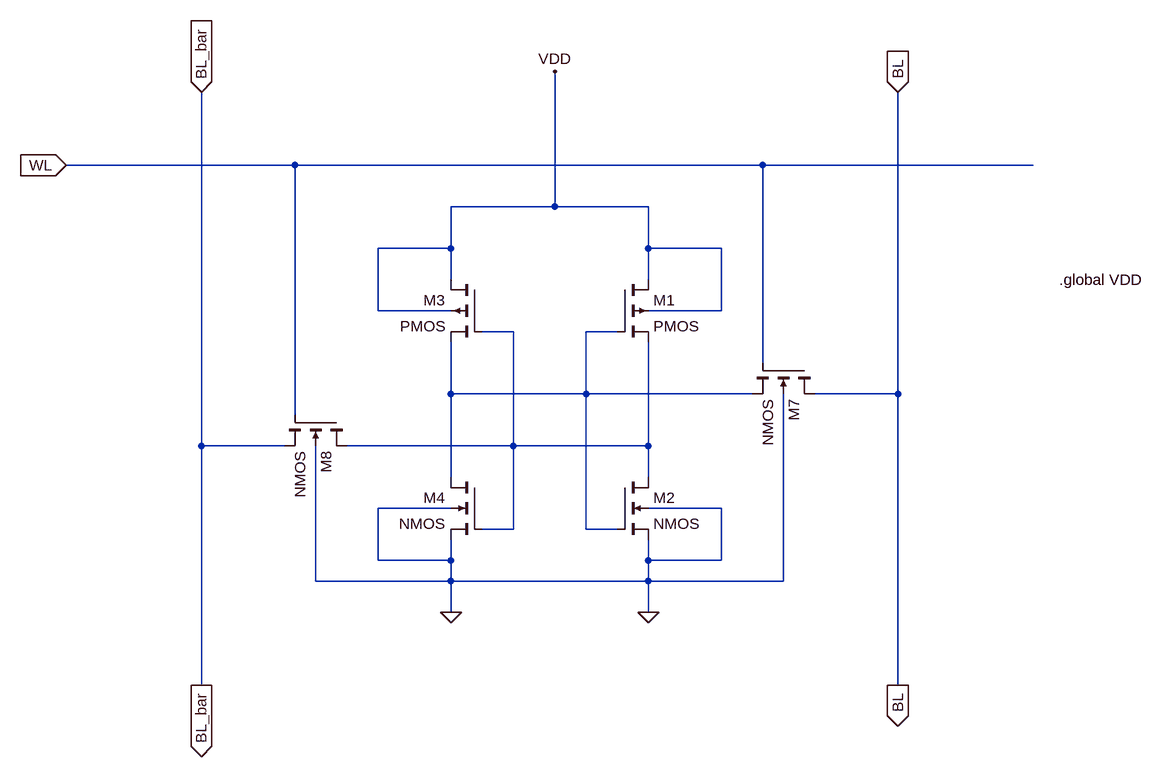
[diagram p0: schematic sram_cell.asc]
sram_cell.asc, the LTspice schematic file:
Version 4
SHEET 1 1028 2284
WIRE -288 -160 -640 -160
WIRE 432 -160 -288 -160
WIRE 848 -160 432 -160
WIRE 112 -96 112 -304
WIRE 112 -96 -48 -96
WIRE 256 -96 112 -96
WIRE -48 -32 -48 -96
WIRE -48 -32 -160 -32
WIRE 256 -32 256 -96
WIRE 368 -32 256 -32
WIRE -48 16 -48 -32
WIRE 256 16 256 -32
WIRE -160 64 -160 -32
WIRE -48 64 -160 64
WIRE 368 64 368 -32
WIRE 368 64 256 64
WIRE 48 96 0 96
WIRE 208 96 160 96
WIRE 432 144 432 -160
WIRE -48 192 -48 112
WIRE 160 192 160 96
WIRE 160 192 -48 192
WIRE 416 192 160 192
WIRE 640 192 640 -272
WIRE 640 192 512 192
WIRE -288 224 -288 -160
WIRE -432 272 -432 -272
WIRE -304 272 -432 272
WIRE 48 272 48 96
WIRE 48 272 -208 272
WIRE 256 272 256 112
WIRE 256 272 48 272
WIRE -48 320 -48 192
WIRE 256 320 256 272
WIRE -48 368 -160 368
WIRE 368 368 256 368
WIRE 48 400 48 272
WIRE 48 400 0 400
WIRE 160 400 160 192
WIRE 208 400 160 400
WIRE -160 448 -160 368
WIRE -48 448 -48 416
WIRE -48 448 -160 448
WIRE 256 448 256 416
WIRE 368 448 368 368
WIRE 368 448 256 448
WIRE -256 480 -256 272
WIRE -48 480 -48 448
WIRE -48 480 -256 480
WIRE 256 480 256 448
WIRE 256 480 -48 480
WIRE 464 480 464 192
WIRE 464 480 256 480
WIRE -48 528 -48 480
WIRE 256 528 256 480
WIRE -432 640 -432 272
WIRE 640 640 640 192
FLAG 256 528 0
FLAG -48 528 0
FLAG -640 -160 WL
IOPIN -640 -160 In
FLAG 112 -304 VDD
FLAG -432 640 BL_bar
IOPIN -432 640 Out
FLAG 640 640 BL
IOPIN 640 640 Out
FLAG 640 -272 BL
IOPIN 640 -272 In
FLAG -432 -272 BL_bar
IOPIN -432 -272 In
SYMBOL pmos4 208 16 R0
SYMATTR InstName M1
SYMATTR Value2 l=0.25u w=0.75u
SYMBOL nmos4 208 320 R0
SYMATTR InstName M2
SYMATTR Value2 l=0.25u w=0.375u
SYMBOL pmos4 0 16 M0
SYMATTR InstName M3
SYMATTR Value2 l=0.25u w=0.75u
SYMBOL nmos4 0 320 M0
SYMATTR InstName M4
SYMATTR Value2 l=0.25u w=0.375u
SYMBOL nmos4 512 144 R90
SYMATTR InstName M7
SYMATTR Value2 l=0.25u w=0.375u
SYMBOL nmos4 -208 224 R90
SYMATTR InstName M8
SYMATTR Value2 l=0.25u w=0.375u
TEXT 888 16 Left 2 !.global VDD

The netlist it stands for:
* sram_cell.asc
M1 VDD N002 N001 VDD PMOS l=0.25u w=0.75u
M2 N001 N002 0 0 NMOS l=0.25u w=0.375u
M3 VDD N001 N002 VDD PMOS l=0.25u w=0.75u
M4 N002 N001 0 0 NMOS l=0.25u w=0.375u
M7 BL WL N002 0 NMOS l=0.25u w=0.375u
M8 N001 WL BL_bar 0 NMOS l=0.25u w=0.375u
.model NMOS NMOS
.model PMOS PMOS
.lib standard.mos
.global VDD
.backanno
.end